# EAGLE design ATTiny Programmer (EAGLE 7.5.0)
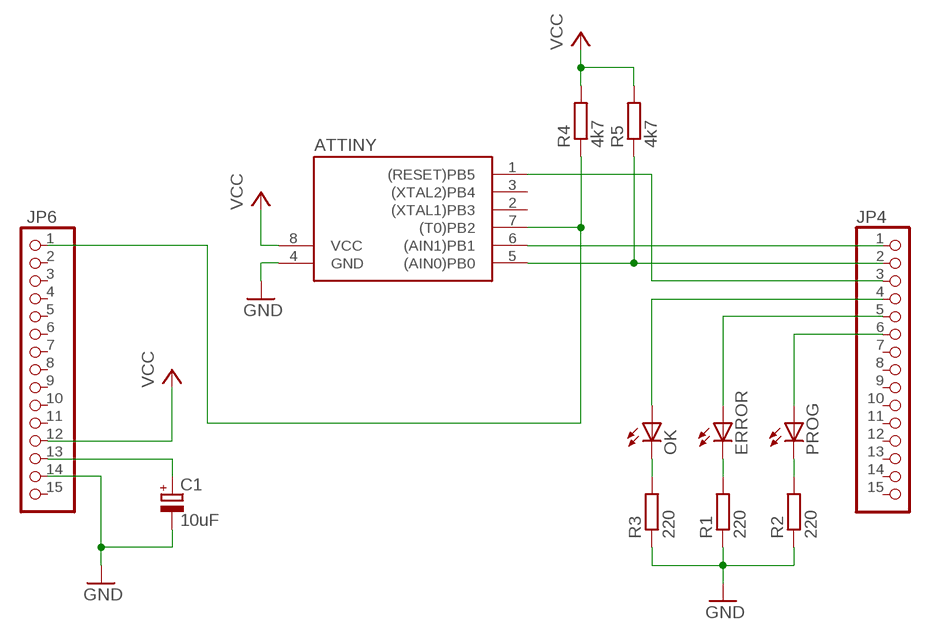
[diagram p0: schematic, sheet 1]

## Parts
ATTINY  TINY10P  [DIL08]
C1  10uF  CPOL-EUE2-4  [E2-4]
ERROR  Error  LED3MM  [LED3MM]
JP4  pinheader1  PINHD-1X15  [1X15]
JP6  pinheader2  PINHD-1X15  [1X15]
OK  Ok  LED3MM  [LED3MM]
PROG  Prog  LED3MM  [LED3MM]
R1  220  R-EU_0207/7  [0207/7]
R2  220  R-EU_0207/7  [0207/7]
R3  220  R-EU_0207/7  [0207/7]
R4  4k7  R-EU_0207/7  [0207/7]
R5  4k7  R-EU_0207/7  [0207/7]

## Nets
GND: ATTINY.4(GND) C1.- JP6.14 R1.1 R2.1 R3.1
N$1: OK.K(C) R3.2
N$2: PROG.K(C) R2.2
N$3: ERROR.K(C) R1.2
N$4: C1.+ JP6.13
N$5: JP4.4 OK.A
N$6: ERROR.A JP4.5
N$7: ATTINY.1((RESET)PB5) JP4.3
N$8: ATTINY.5((AIN0)PB0) JP4.2 R5.1
N$9: ATTINY.6((AIN1)PB1) JP4.1
N$10: ATTINY.7((T0)PB2) JP6.1 R4.1
N$11: JP4.6 PROG.A
VCC: ATTINY.8(VCC) JP6.12 R4.2 R5.2
Unconnected: ATTINY.2((XTAL1)PB3) ATTINY.3((XTAL2)PB4) JP4.7 JP4.8 JP4.9 JP4.10 JP4.11 JP4.12 JP4.13 JP4.14 JP4.15 JP6.2 JP6.3 JP6.4 JP6.5 JP6.6 JP6.7 JP6.8 JP6.9 JP6.10 JP6.11 JP6.15

## Library data of the parts
ATTINY = atmel:TINY10: MICROCONTROLLER 1 Kbytes ROM; OC_FARNELL: unknown; OC_NEWARK: unknown
C1 = rcl:CPOL-EU: POLARIZED CAPACITOR, European symbol
ERROR OK PROG = led:LED: LED OSRAM: - CHIPLED LG R971, LG N971, LY N971, LG Q971, LY Q971, LO R971, LY R971 LH N974, LH R974 LS Q976, LO Q976, LY Q976 LO Q996 - Hyper CHIPLED LW Q18S LB Q993, LB Q99A, LB R99A - SideLED LS A670, LO A670, LY A670, LG A670, LP A670 LB A673, LV A673, LT A673, LW A673 LH A674 LY A675 LS A676, LA A676, LO A676, LY A676, LW A676 LS A679, LY A679, LG A679 - Hyper Micro SIDELED® LS Y876, LA Y876, LO Y876, LY Y876 LT Y87S - SmartLED LW L88C, LW L88S LB L89C, LB L89S, LG L890 LS L89K, LO L89K, LY L89K LS L896, LA L896, LO L896, LY L896 - TOPLED LS T670, LO T670, LY T670, LG T670, LP T670 LSG T670, LSP T670, LSY T670, LOP T670, LYG T670 LG T671, LOG T671, LSG T671 LB T673, LV T673, LT T673, LW T673 LH T674 LS T676, LA T676, LO T676, LY T676, LB T676, LH T676, LSB T676, LW T676 LB T67C, LV T67C, LT T67C, LS T67K, LO T67K, LY T67K, LW E67C LS E67B, LA E67B, LO E67B, LY E67B, LB E67C, LV E67C, LT E67C LW T67C LS T679, LY T679, LG T679 LS T770, LO T770, LY T770, LG T770, LP T770 LB T773, LV T773, LT T773, LW T773 LH T774 LS E675, LA E675, LY E675, LS T675 LS T776, LA T776, LO T776, LY T776, LB T776 LHGB T686 LT T68C, LB T68C - Hyper Mini TOPLED® LB M676 - Mini TOPLED Santana® LG M470 LS M47K, LO M47K, LY M47K Source: http://www.osram.convergy.de LUXEON: - LUMILED® LXK2-PW12-R00, LXK2-PW12-S00, LXK2-PW14-U00, LXK2-PW14-V00 LXK2-PM12-R00, LXK2-PM12-S00, LXK2-PM14-U00 LXK2-PE12-Q00, LXK2-PE12-R00, LXK2-PE12-S00, LXK2-PE14-T00, LXK2-PE14-U00 LXK2-PB12-K00, LXK2-PB12-L00, LXK2-PB12-M00, LXK2-PB14-N00, LXK2-PB14-P00, LXK2-PB14-Q00 LXK2-PR12-L00, LXK2-PR12-M00, LXK2-PR14-Q00, LXK2-PR14-R00 LXK2-PD12-Q00, LXK2-PD12-R00, LXK2-PD12-S00 LXK2-PH12-R00, LXK2-PH12-S00 LXK2-PL12-P00, LXK2-PL12-Q00, LXK2-PL12-R00 Source: www.luxeon.com KINGBRIGHT: KA-3528ASYC Source: www.kingbright.com
JP4 JP6 = PINHD8:90:PINHD-1X15: PIN HEADER
R1-R5 = rcl:R-EU_: RESISTOR, European symbol

## Board
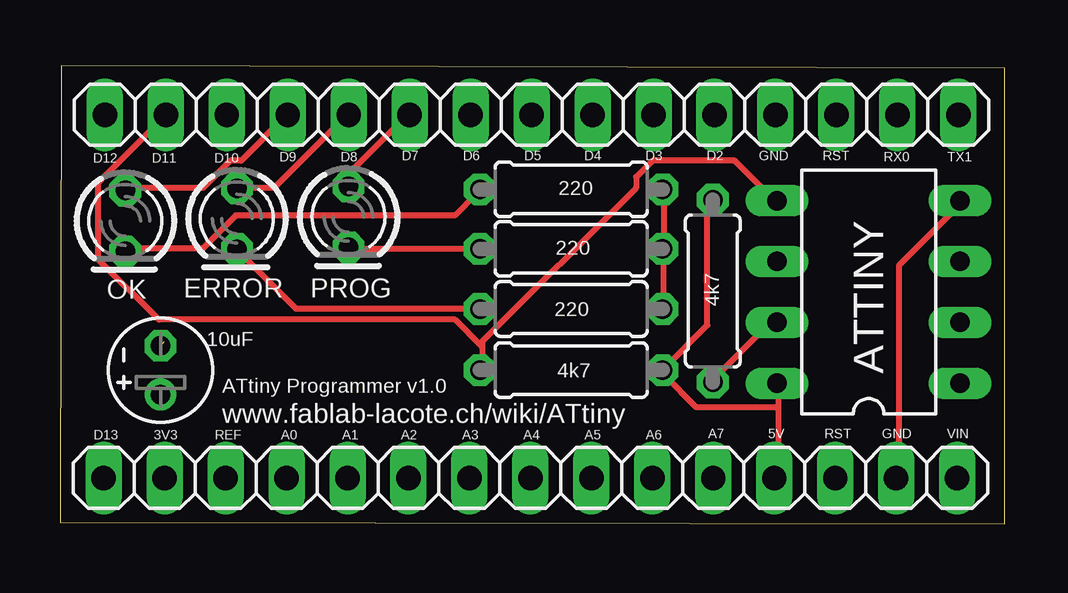
[diagram p1: board, top side]
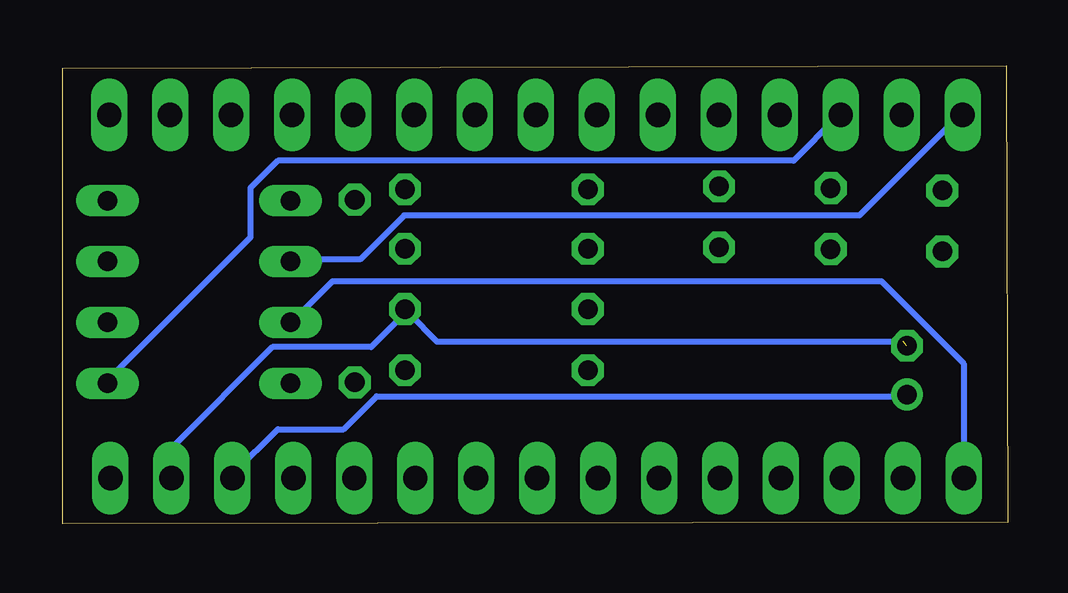
[diagram p2: board, bottom side, seen from below]

Size 39.37 x 19.1 mm. Coordinates in mm from the lower left corner, seen from the top.
Outline: 0,0.05 39.37,0 39.37,19 0.05,19.1 0,0.05
Copper layers (1*16): Top 0.035mm / dielectric 1.5mm / Bottom 0.035mm
Design rules "default": minimum track width 10mil, minimum drill 24mil, track to track 8mil, track to pad 8mil, pad to pad 8mil, via to via 8mil, smd to smd 8mil, copper to edge 40mil, drill to drill 8mil, minimum pad ring 10mil, minimum via ring 8mil, stop-mask expansion 4mil, vias tented up to drill 0mil, thermal gap 10mil

### Footprints (pad centres in the part's own frame; a part is rotated, then mirrored left to right if it is on the bottom)
DIL08 = drill 0.813 long: 1 -3.81,-3.81; 2 -1.27,-3.81; 3 1.27,-3.81; 4 3.81,-3.81; 5 3.81,3.81; 6 1.27,3.81; 7 -1.27,3.81; 8 -3.81,3.81
E2-4 = drill 0.813 pad 1.27: + -1.016,0 | drill 0.813 pad 1.27 octagon: - 1.016,0
LED3MM = drill 0.813 octagon: A -1.27,0; K 1.27,0
1X15 = drill 1.016 long: 1 -17.78,0; 2 -15.24,0; 3 -12.7,0; 4 -10.16,0; 5 -7.62,0; 6 -5.08,0; 7 -2.54,0; 8 0,0; 9 2.54,0; 10 5.08,0; 11 7.62,0; 12 10.16,0; 13 12.7,0; 14 15.24,0; 15 17.78,0
0207/7 = drill 0.813 octagon: 1 -3.81,0; 2 3.81,0

### Placement (x,y rotation side)
ATTINY  33.69,9.66 90 top
C1  4.19,6.4 90 top
ERROR  7.37,12.72 270 top
JP4  19.65,17.05 0 top
JP6  19.6,1.9 0 top
OK  2.72,12.62 270 top
PROG  12.02,12.79 270 top
R1  21.3,8.95 180 top
R2  21.3,11.46 180 top
R3  21.3,13.94 180 top
R4  27.2,9.7 90 top
R5  21.3,6.4 0 top

### Tracks (layer width: path | path; a pad name or v marks a point on that pad's centre or on a via)
GND  (1 unrouted)
  Top 0.254: ATTINY.4 37.49,13.31 34.98,10.79 34.98,2.11 JP6.14 | R3.1 25.15,13.77 25.15,11.48 R2.1 25.15,11.25 25.15,8.96 R1.1
  Bottom 0.254: 4.34,7.59 23.77,7.59 24.92,8.74 R1.1 25.15,8.74 26.52,7.37 30.63,7.37 34.75,3.25 34.75,2.11 JP6.14
N$1
  Top 0.254: OK.K 2.74,11.48 5.94,11.48 7.32,12.85 16.46,12.85 17.37,13.77 R3.2
N$2
  Top 0.254: R2.2 17.37,11.48 12.12,11.48 PROG.K
N$3
  Top 0.254: R1.2 17.37,8.96 9.83,8.96 7.54,11.25 ERROR.K
N$4
  Bottom 0.254: C1.+ 4.34,5.31 26.29,5.31 27.66,3.94 30.4,3.94 32.23,2.11 JP6.13
N$5
  Top 0.254: OK.A 2.74,14 5.94,14 7.09,15.14 7.54,15.14 9.37,16.97 JP4.4
N$6
  Top 0.254: ERROR.A 7.54,14 8.91,14 11.89,16.97 JP4.5
N$7
  Bottom 0.254: ATTINY.1 37.49,5.99 31.55,11.94 31.55,14 30.4,15.14 8.91,15.14 7.09,16.97 JP4.3
N$8
  Top 0.254: 17.6,7.37 17.6,7.59 24,14 24,14.45 24.69,15.14 28.12,15.14 29.72,13.54 ATTINY.5 | 17.6,7.37 17.6,6.45 R5.1 | 17.6,7.37 16.46,8.51 4.12,8.51 1.6,11.02 1.6,14.22 4.34,16.97 JP4.2
N$9
  Bottom 0.254: ATTINY.6 29.72,11.02 26.98,11.02 25.15,12.85 6.17,12.85 2.06,16.97 JP4.1
N$10
  Top 0.254: R4.1 27.2,5.99 29.72,8.51 ATTINY.7
  Bottom 0.254: JP6.1 1.83,2.11 1.83,6.68 5.26,10.11 28.12,10.11 29.72,8.51 ATTINY.7
N$11
  Top 0.254: PROG.A 12.12,14.22 12.12,14.68 14.4,16.97 JP4.6
VCC
  Top 0.254: 29.95,4.85 29.95,2.11 JP6.12 | 29.95,4.85 29.95,5.76 ATTINY.8 | 29.95,4.85 26.52,4.85 25.15,6.22 R5.2 25.15,6.45 26.98,8.28 26.98,13.31 R4.2

### Text on the board
tPlace: D7 | D6 | D5 | D4 | D3 | D2 | GND | RST | D12 | D11 | D10 | D9 | D8 | RX0 | TX1 | ATtiny Programmer v1.0 | www.fablab-lacote.ch/wiki/ATtiny | A7 | 5V | RST | GND | VIN | D13 | 3V3 | REF | A0 | A1 | A2 | A3 | A4 | A5 | A6